# Altium schematic sheet senror_input.SchDoc
size A3
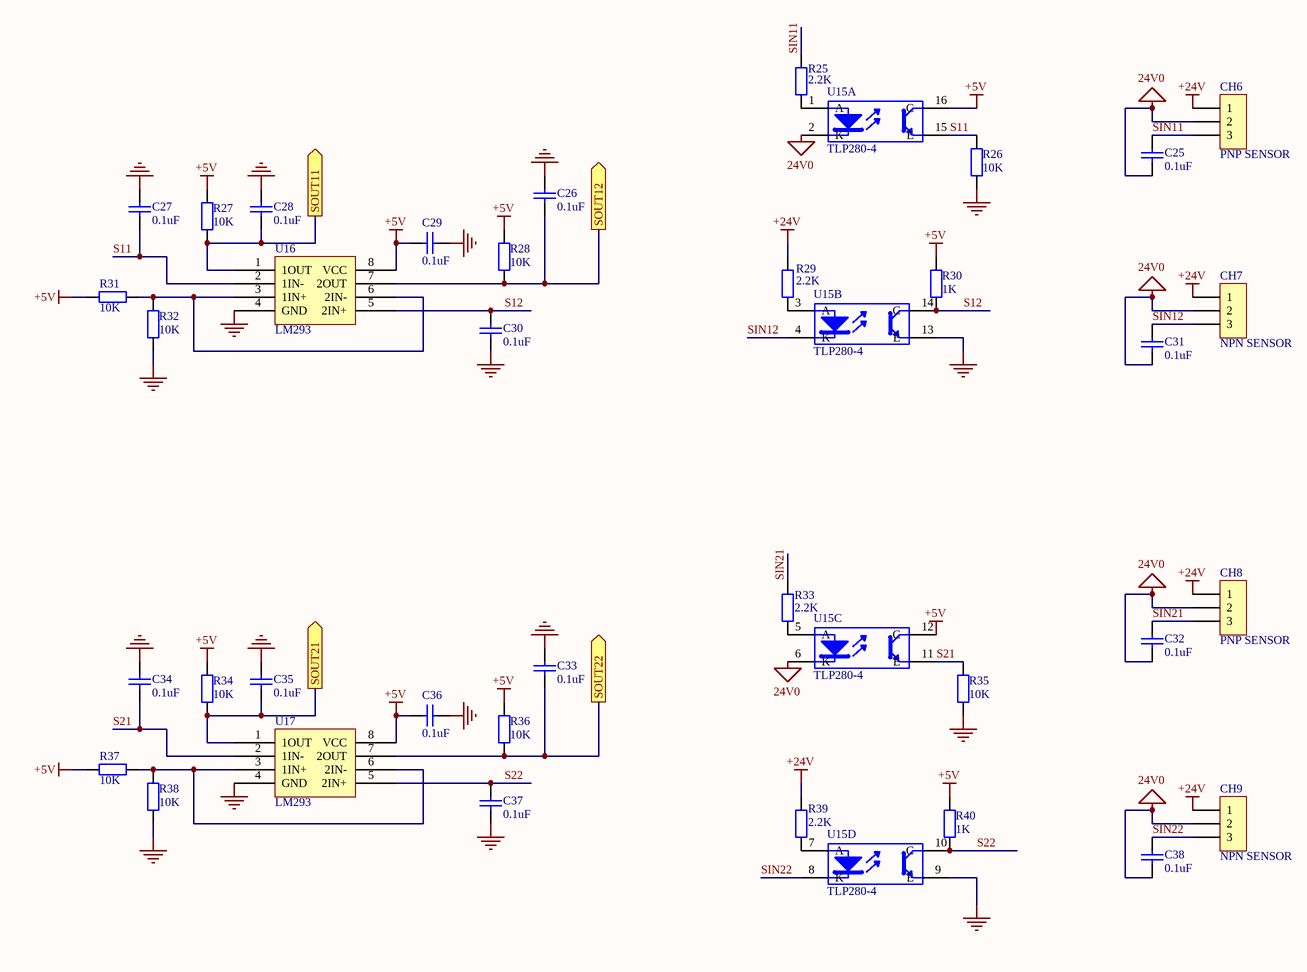
[diagram p0: senror_input.SchDoc]

## Parts
C25  value 0.1uF  [0805]  (hidden comment: Cap)
C26  value 0.1uF  [0805]  (hidden comment: Cap)
C27  value 0.1uF  [0805]  (hidden comment: Cap)
C28  value 0.1uF  [0805]  (hidden comment: Cap)
C29  value 0.1uF  [0805]  (hidden comment: Cap)
C30  value 0.1uF  [0805]  (hidden comment: Cap)
C31  value 0.1uF  [0805]  (hidden comment: Cap)
C32  value 0.1uF  [0805]  (hidden comment: Cap)
C33  value 0.1uF  [0805]  (hidden comment: Cap)
C34  value 0.1uF  [0805]  (hidden comment: Cap)
C35  value 0.1uF  [0805]  (hidden comment: Cap)
C36  value 0.1uF  [0805]  (hidden comment: Cap)
C37  value 0.1uF  [0805]  (hidden comment: Cap)
C38  value 0.1uF  [0805]  (hidden comment: Cap)
CH6  HEADER1X3  [CH3.96-3PIN]  (value not drawn)
CH7  HEADER1X3  [CH3.96-3PIN]  (value not drawn)
CH8  HEADER1X3  [CH3.96-3PIN]  (value not drawn)
CH9  HEADER1X3  [CH3.96-3PIN]  (value not drawn)
R25  value 2.2K  [0805]  (hidden comment: Res2)
R26  value 10K  [0805]  (hidden comment: Res2)
R27  value 10K  [0805]  (hidden comment: Res2)
R28  value 10K  [0805]  (hidden comment: Res2)
R29  value 2.2K  [0805]  (hidden comment: Res2)
R30  value 1K  [0805]  (hidden comment: Res2)
R31  value 10K  [0805]  (hidden comment: Res2)
R32  value 10K  [0805]  (hidden comment: Res2)
R33  value 2.2K  [0805]  (hidden comment: Res2)
R34  value 10K  [0805]  (hidden comment: Res2)
R35  value 10K  [0805]  (hidden comment: Res2)
R36  value 10K  [0805]  (hidden comment: Res2)
R37  value 10K  [0805]  (hidden comment: Res2)
R38  value 10K  [0805]  (hidden comment: Res2)
R39  value 2.2K  [0805]  (hidden comment: Res2)
R40  value 1K  [0805]  (hidden comment: Res2)
U15  TLP280-4  [SO16]  (parts A,B,C,D of 4)
U16  LM293  [SOP8-OP27]
U17  LM293  [SOP8-OP27]

## Ports
SOUT11 (out), SOUT12 (out), SOUT21 (out), SOUT22 (out)

## Nets
24V0: C25.2 C31.2 C32.2 C38.2 CH6.2 CH7.2 CH8.2 CH9.2 U15.2(K) U15.6(K)
+5V: C29.2 C36.2 R27.1 R28.1 R30.1 R31.1 R34.1 R36.1 R37.1 R40.1 U15.12(C) U15.16(C) U16.8(VCC) U17.8(VCC)
+24V: CH6.1 CH7.1 CH8.1 CH9.1 R29.1 R39.1
GND: C26.1 C27.1 C28.1 C29.1 C30.1 C33.1 C34.1 C35.1 C36.1 C37.1 R26.2 R32.2 R35.2 R38.2 U15.9(E) U15.13(E) U16.4(GND) U17.4(GND)
S11: C27.2 R26.1 U15.15(E) U16.2(1IN-)
S12: C30.2 R30.2 U15.14(C) U16.5(2IN+)
S21: C34.2 R35.1 U15.11(E) U17.2(1IN-)
S22: C37.2 R40.2 U15.10(C) U17.5(2IN+)
SIN11: C25.1 CH6.3 R25.1
SIN12: C31.1 CH7.3 U15.4(K)
SIN21: C32.1 CH8.3 R33.1
SIN22: C38.1 CH9.3 U15.8(K)
SOUT11: C28.2 R27.2 U16.1(1OUT) ; port SOUT11
SOUT12: C26.2 R28.2 U16.7(2OUT) ; port SOUT12
SOUT21: C35.2 R34.2 U17.1(1OUT) ; port SOUT21
SOUT22: C33.2 R36.2 U17.7(2OUT) ; port SOUT22
NetR25_2: R25.2 U15.1(A)
NetR29_2: R29.2 U15.3(A)
NetR31_2: R31.2 R32.1 U16.3(1IN+) U16.6(2IN-)
NetR33_2: R33.2 U15.5(A)
NetR37_2: R37.2 R38.1 U17.3(1IN+) U17.6(2IN-)
NetR39_2: R39.2 U15.7(A)

## Notes on the sheet
- (in symbol HEADER1X3) PNP SENSOR; NPN SENSOR

## Library data of the parts
C25-C38 = Cap: Capacitor; Published: 8-Jun-2000; LatestRevisionDate: 17-Jul-2002; LatestRevisionNote: Re-released for DXP Platform.; PackageReference: RAD-0.3; Publisher: Altium Limited
R25-R40 = Res2: Resistor; Published: 8-Jun-2000; LatestRevisionDate: 17-Jul-2002; LatestRevisionNote: Re-released for DXP Platform.; PackageReference: AXIAL-0.4; Publisher: Altium Limited
U15 = TLP521-4